# Altium project lora-carrier-board.PrjPcb
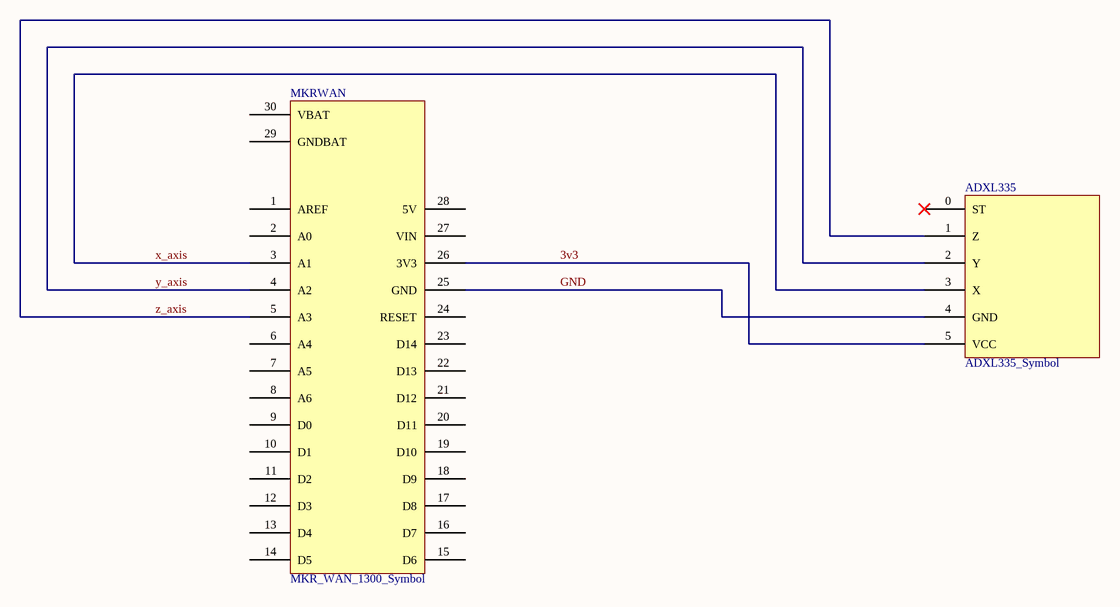
[diagram p0: sheet1.SchDoc]
1 sheet, 2 parts. Net scope: global (net labels, ports and power ports of the same name join across sheets).
Board file: PCB1.PcbDoc

## Sheet sheet1.SchDoc
size A4; SheetNumber: 1; SheetTotal: 1

### Parts
ADXL335  ADXL335_Symbol  [ADXL335_HEADERS]
MKRWAN  MKR_WAN_1300_Symbol  [MKR_WAN_1300_Headers]

### Nets
3v3: ADXL335.5(VCC) MKRWAN.26(3V3)
GND: ADXL335.4(GND) MKRWAN.25(GND)
x_axis: ADXL335.3(X) MKRWAN.3(A1)
y_axis: ADXL335.2(Y) MKRWAN.4(A2)
z_axis: ADXL335.1(Z) MKRWAN.5(A3)

Not connected (* = marked no-connect by the designer): ADXL335 0(ST)*; MKRWAN 1(AREF) 2(A0) 6(A4) 7(A5) 8(A6) 9(D0) 10(D1) 11(D2) 12(D3) 13(D4) 14(D5) 15(D6) 16(D7) 17(D8) 18(D9) 19(D10) 20(D11) 21(D12) 22(D13) 23(D14) 24(RESET) 27(VIN) 28(5V) 29(GNDBAT) 30(VBAT)